# EAGLE design TruthMeterV2 (EAGLE 5.11)
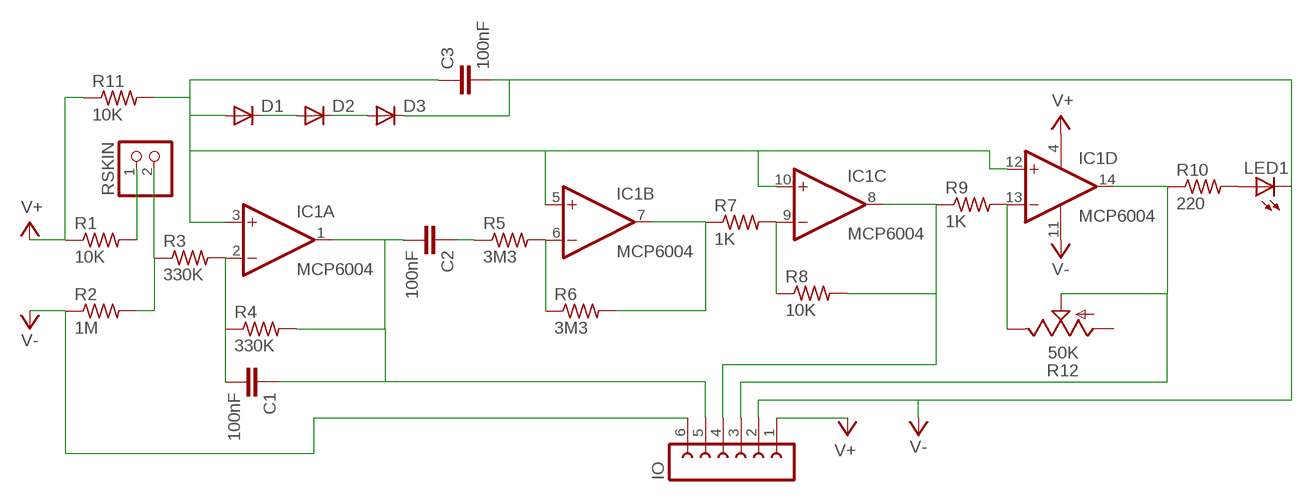
[diagram p0: schematic, sheet 1]

## Parts
C1  100nF  C2,5-3  [C2.5-3]
C2  100nF  C2,5-3  [C2.5-3]
C3  100nF  C2,5-3  [C2.5-3]
D1  1N4148DO35-7  [DO35-7]
D2  1N4148DO35-7  [DO35-7]
D3  1N4148DO35-7  [DO35-7]
IC1  MCP6004  MCP604P  [DIL14]
IO  FE06-1  [FE06]
LED1  LED10MM  [LED10MM]
R1  10K  R-US_0204/7  [0204/7]
R2  1M  R-US_0204/7  [0204/7]
R3  330K  R-US_0204/7  [0204/7]
R4  330K  R-US_0204/7  [0204/7]
R5  3M3  R-US_0204/7  [0204/7]
R6  3M3  R-US_0204/7  [0204/7]
R7  1K  R-US_0204/7  [0204/7]
R8  10K  R-US_0204/7  [0204/7]
R9  1K  R-US_0204/7  [0204/7]
R10  220  R-US_0204/7  [0204/7]
R11  10K  R-US_0204/7  [0204/7]
R12  50K  TRIM_US-CA6V  [CA6V]
RSKIN  PINHD-1X2  [1X02]

## Nets
N$1: R1.2 RSKIN.1
N$2: R2.2 R3.1 RSKIN.2
N$3: C1.2 IC1.2(A:-IN) R3.2 R4.1
N$5: C2.1 R5.1
N$6: IC1.6(B:-IN) R5.2 R6.1
N$7: IC1.7(B:OUT) R6.2 R7.1
N$8: IC1.9(C:-IN) R7.2 R8.1
N$9: IC1.8(C:OUT) IO.4 R8.2 R9.1
N$10: IC1.13(D:-IN) R9.2 R12.E
N$12: D1.C D2.A
N$13: D2.C D3.A
N$14: IC1.14(D:OUT) IO.3 R10.1 R12.S
N$15: LED1.A R10.2
N$18: C3.1 D1.A IC1.3(A:+IN) IC1.5(B:+IN) IC1.10(C:+IN) IC1.12(D:+IN) R11.2
N$19: C1.1 C2.2 IC1.1(A:OUT) IO.5 R4.2
V+: IC1.4(P:V+) IO.1 R1.1 R11.1
V-: C3.2 D3.C IC1.11(P:V-) IO.2 IO.6 LED1.K(C) R2.1
Unconnected: R12.A

## Library data of the parts
C1-C3 = capacitor-wima:C: CAPACITOR naming: grid - package width
D1-D3 = diode:1N4148: DIODE high speed (Philips)
IC1 = linear:MCP604: Quad Op Amp 2.7V to 6.0V Single Supply CMOS Source: http://ww1.microchip.com/downloads/en/DeviceDoc/21314g.pdf
IO = con-lsta:FE06-1: FEMALE HEADER; OC_FARNELL: unknown; OC_NEWARK: unknown
LED1 = led:LED: LED OSRAM: - CHIPLED LG R971, LG N971, LY N971, LG Q971, LY Q971, LO R971, LY R971 LH N974, LH R974 LS Q976, LO Q976, LY Q976 LO Q996 - Hyper CHIPLED LW Q18S LB Q993, LB Q99A, LB R99A - SideLED LS A670, LO A670, LY A670, LG A670, LP A670 LB A673, LV A673, LT A673, LW A673 LH A674 LY A675 LS A676, LA A676, LO A676, LY A676, LW A676 LS A679, LY A679, LG A679 - Hyper Micro SIDELED® LS Y876, LA Y876, LO Y876, LY Y876 LT Y87S - SmartLED LW L88C, LW L88S LB L89C, LB L89S, LG L890 LS L89K, LO L89K, LY L89K LS L896, LA L896, LO L896, LY L896 - TOPLED LS T670, LO T670, LY T670, LG T670, LP T670 LSG T670, LSP T670, LSY T670, LOP T670, LYG T670 LG T671, LOG T671, LSG T671 LB T673, LV T673, LT T673, LW T673 LH T674 LS T676, LA T676, LO T676, LY T676, LB T676, LH T676, LSB T676, LW T676 LB T67C, LV T67C, LT T67C, LS T67K, LO T67K, LY T67K, LW E67C LS E67B, LA E67B, LO E67B, LY E67B, LB E67C, LV E67C, LT E67C LW T67C LS T679, LY T679, LG T679 LS T770, LO T770, LY T770, LG T770, LP T770 LB T773, LV T773, LT T773, LW T773 LH T774 LS E675, LA E675, LY E675, LS T675 LS T776, LA T776, LO T776, LY T776, LB T776 LHGB T686 LT T68C, LB T68C - Hyper Mini TOPLED® LB M676 - Mini TOPLED Santana® LG M470 LS M47K, LO M47K, LY M47K Source: http://www.osram.convergy.de LUXEON: - LUMILED® LXK2-PW12-R00, LXK2-PW12-S00, LXK2-PW14-U00, LXK2-PW14-V00 LXK2-PM12-R00, LXK2-PM12-S00, LXK2-PM14-U00 LXK2-PE12-Q00, LXK2-PE12-R00, LXK2-PE12-S00, LXK2-PE14-T00, LXK2-PE14-U00 LXK2-PB12-K00, LXK2-PB12-L00, LXK2-PB12-M00, LXK2-PB14-N00, LXK2-PB14-P00, LXK2-PB14-Q00 LXK2-PR12-L00, LXK2-PR12-M00, LXK2-PR14-Q00, LXK2-PR14-R00 LXK2-PD12-Q00, LXK2-PD12-R00, LXK2-PD12-S00 LXK2-PH12-R00, LXK2-PH12-S00 LXK2-PL12-P00, LXK2-PL12-Q00, LXK2-PL12-R00 Source: www.luxeon.com KINGBRIGHT: KA-3528ASYC Source: www.kingbright.com
R1-R11 = rcl:R-US_: RESISTOR, American symbol
R12 = pot:TRIM_US-: POTENTIOMETER
RSKIN = pinhead:PINHD-1X2: PIN HEADER

## Board
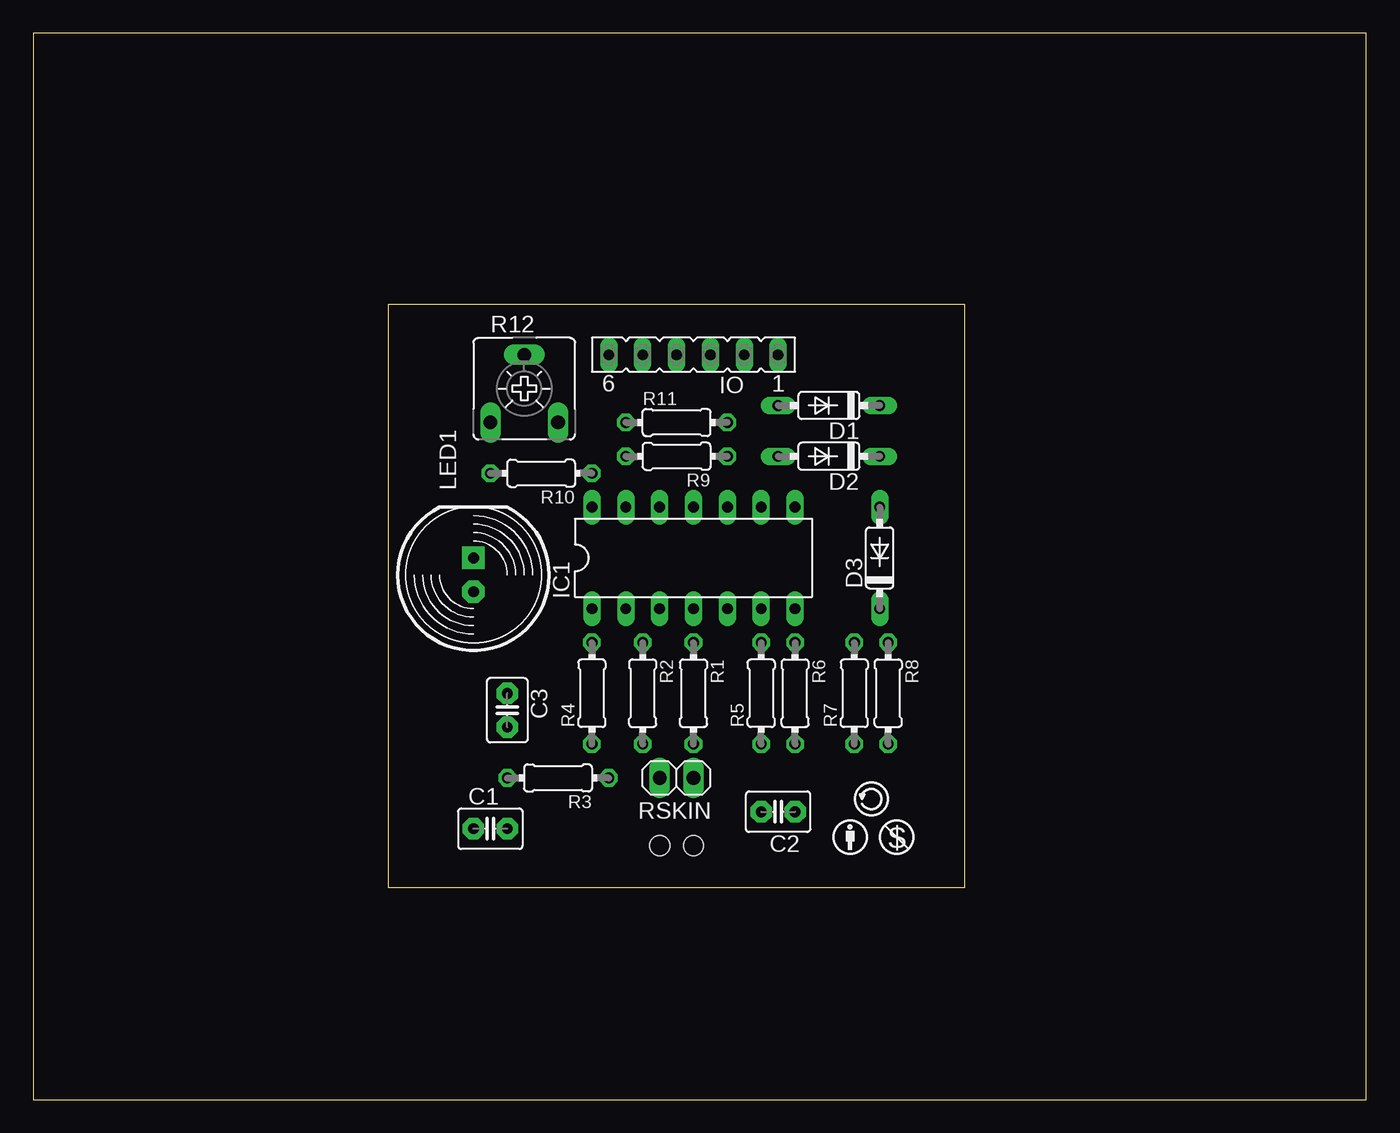
[diagram p1: board, top side]
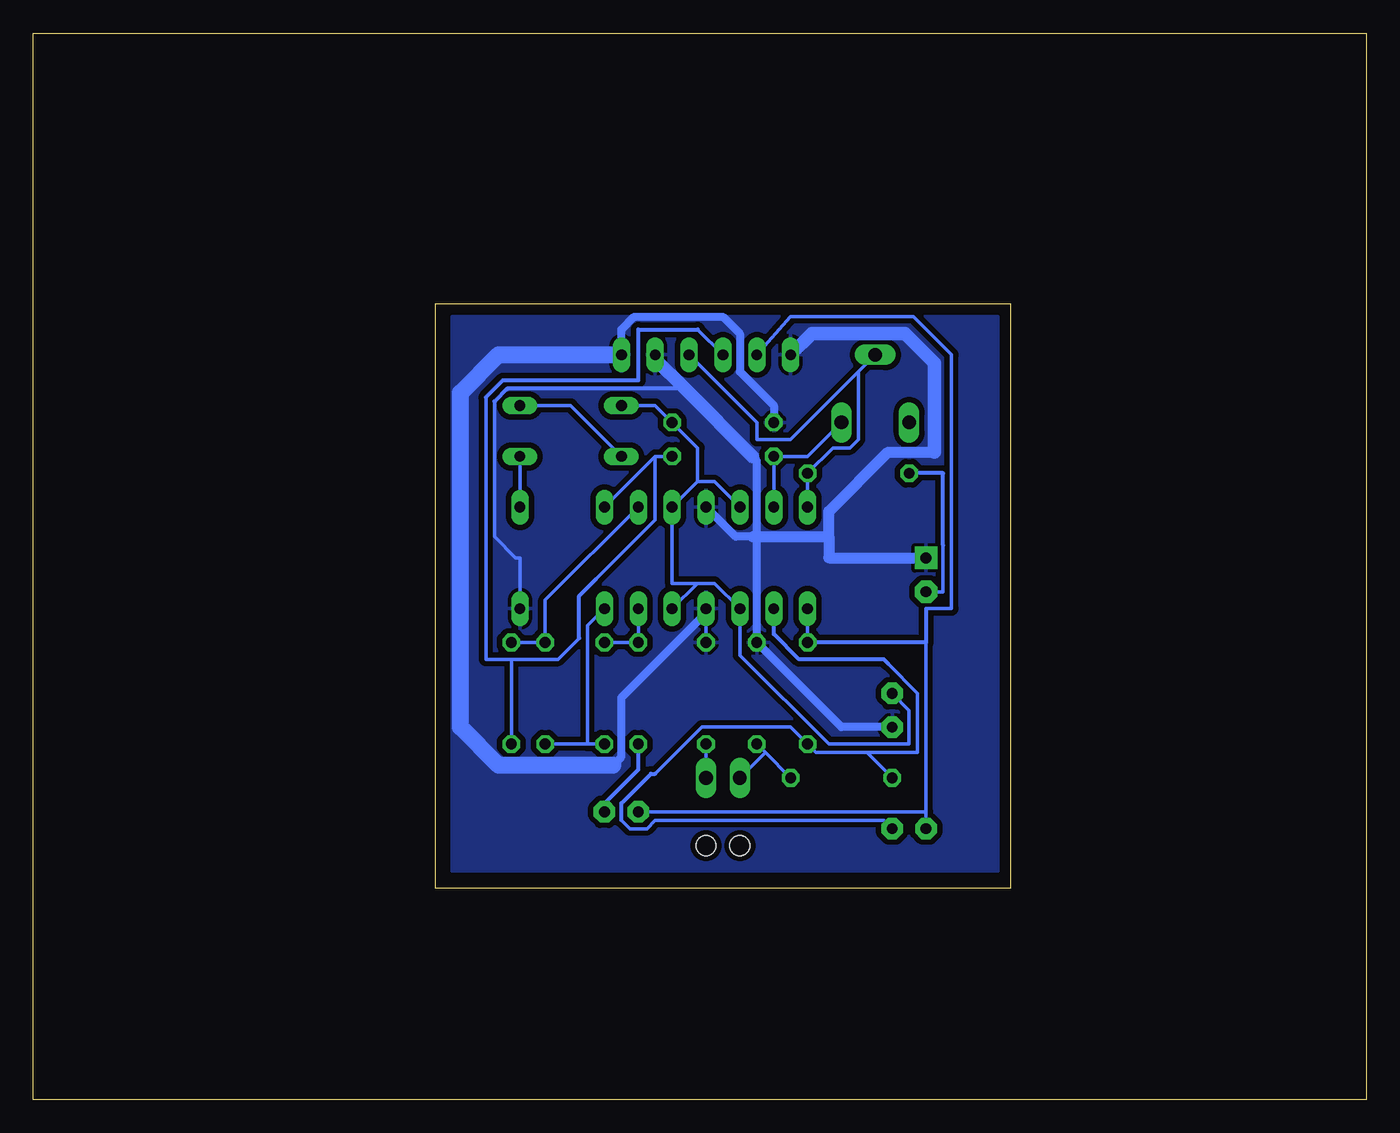
[diagram p2: board, bottom side, seen from below]

Size 100 x 80 mm. Coordinates in mm from the lower left corner, seen from the top.
Outline: 0,0 100,0 100,80 0,80 0,0
Outline: 26.67,59.69 69.85,59.69 69.85,15.88 26.67,15.88 26.67,59.69
Copper layers (1*16): Top 0.035mm / dielectric 1.5mm / Bottom 0.035mm
Design rules "default *": minimum track width 10mil, minimum drill 24mil, track to track 8mil, track to pad 8mil, pad to pad 8mil, via to via 8mil, smd to smd 8mil, copper to edge 15mil, drill to drill 8mil, minimum pad ring 10mil, minimum via ring 8mil, stop-mask expansion 4mil, vias tented up to drill 0mil, thermal gap 10mil
Holes 1.5 mm at 46.99,19.05 49.53,19.05

### Footprints (pad centres in the part's own frame; a part is rotated, then mirrored left to right if it is on the bottom)
C2.5-3 = drill 0.813 pad 1.6 octagon: 1 -1.27,0; 2 1.27,0
DO35-7 = drill 0.813 long: A 3.81,0; C -3.81,0
DIL14 = drill 0.813 long: 1 -7.62,-3.81; 2 -5.08,-3.81; 3 -2.54,-3.81; 4 0,-3.81; 5 2.54,-3.81; 6 5.08,-3.81; 7 7.62,-3.81; 8 7.62,3.81; 9 5.08,3.81; 10 2.54,3.81; 11 0,3.81; 12 -2.54,3.81; 13 -5.08,3.81; 14 -7.62,3.81
FE06 = drill 0.813 long: 1 -6.35,0; 2 -3.81,0; 3 -1.27,0; 4 1.27,0; 5 3.81,0; 6 6.35,0
LED10MM = drill 0.813 pad 1.676 octagon: A -1.27,0 | drill 0.813 pad 1.676 square: K 1.27,0
0204/7 = drill 0.813 octagon: 1 -3.81,0; 2 3.81,0
CA6V = drill 1.016 long: A -2.54,-2.54; E 2.54,-2.54; S 0,2.54
1X02 = drill 1.016 long: 1 -1.27,0; 2 1.27,0

### Placement (x,y rotation side)
C1  34.29,20.32 0 top
C2  55.88,21.59 180 top
C3  35.56,29.21 270 top
D1  59.69,52.07 180 top
D2  59.69,48.26 180 top
D3  63.5,40.64 90 top
IC1  49.53,40.64 0 top
IO  49.53,55.88 180 top
LED1  33.02,39.37 90 top
R1  49.53,30.48 270 top
R2  45.72,30.48 270 top
R3  39.37,24.13 180 top
R4  41.91,30.48 90 top
R5  54.61,30.48 90 top
R6  57.15,30.48 270 top
R7  61.59,30.48 90 top
R8  64.14,30.48 270 top
R9  48.26,48.26 180 top
R10  38.1,46.99 180 top
R11  48.26,50.8 0 top
R12  36.83,53.34 0 top
RSKIN  48.26,24.13 180 top
U$1  [CC_LICENSE_BY]  61.28,19.68 0 top
U$2  [CC_LICENSE_SA]  62.87,22.54 0 top
U$3  [CC_LICENSE_NC]  64.77,19.68 0 top

### Tracks (layer width: path | path; a pad name or v marks a point on that pad's centre or on a via)
N$1
  Bottom 0.254: RSKIN.1 R1.2
N$2
  Bottom 0.254: 45.09,26.04 R2.2 | R3.1 45.09,26.04 | 45.09,26.04 RSKIN.2
N$3
  Bottom 0.254: 37.47,26.04 R3.2 | 37.47,26.04 41.27,26.04 R4.1 43.18,27.94 49.85,27.94 53.34,24.45 | 35.88,32.7 33.66,30.48 33.66,26.04 37.47,26.04 | C1.2 36.2,20.95 53.34,20.95 53.98,20.32 55.24,20.32 55.88,20.95
  Bottom 0.305: 53.34,24.45 53.66,24.45 55.88,22.23 55.88,20.95 | IC1.2 44.45,34.92 42.55,33.02 36.2,33.02 35.88,32.7
N$5
  Bottom 0.305: C2.1 57.15,22.23 54.61,24.77 R5.1
N$6
  Bottom 0.254: IC1.6 R5.2 R6.1
N$7
  Bottom 0.254: 58.42,26.67 R7.1 | R6.2 58.42,26.67 | IC1.7 58.42,35.56 58.42,26.67
N$8
  Bottom 0.254: R8.1 R7.2 61.59,37.47 IC1.9
N$9
  Bottom 0.254: 53.34,48.26 IC1.8 | 53.34,48.26 R9.1 | R8.2 64.14,33.02 | 64.14,33.02 60.64,33.02 59.05,34.61 | 57.78,39.05 53.34,43.5 53.34,48.26 | 50.16,57.78 IO.4 | 66.04,52.7 66.04,33.02 64.14,33.02
  Bottom 0.305: 50.16,57.78 54.61,57.78 54.61,53.98 64.77,53.98 66.04,52.7 | 59.05,34.61 59.05,37.78 57.78,39.05
N$10
  Bottom 0.254: IC1.13 R9.2 41.91,48.26 R12.E
N$12
  Bottom 0.254: D2.A 59.69,52.07 D1.C
N$13
  Bottom 0.254: D3.A D2.C
N$14
  Bottom 0.254: IC1.14 R10.1 40.01,48.9 38.73,48.9 38.1,49.53 38.1,54.61 | IO.3 45.72,50.8 45.72,49.53 43.18,49.53 38.1,54.61 | 38.1,54.61 R12.S
N$15
  Bottom 0.254: 31.75,41.59 31.75,38.1 LED1.A
  Bottom 0.305: 31.75,41.59 31.75,46.99 R10.2
N$18
  Bottom 0.254: D1.A 53.34,52.07 R11.2 50.16,48.9 50.16,46.35 | IC1.12 48.9,46.35 50.16,46.35 | 50.16,46.35 IC1.10 52.07,38.73 50.16,38.73 | 50.16,38.73 48.9,38.73 IC1.3 46.99,33.34 40.32,26.67 34.29,26.67 34.29,29.21 C3.1 | 50.16,38.73 IC1.5
N$19
  Bottom 0.254: R4.2 IC1.1 | IO.5 43.18,58.74 33.97,58.74 31.11,55.88 31.11,36.83 33.02,36.83 33.02,21.59 | C1.1 33.02,21.59 | 33.02,21.59 C2.2
  Bottom 0.305: 33.02,36.83 33.02,34.29 R4.2
V+
  Bottom 0.254: IC1.4 R1.1
  Bottom 0.61: R11.1 44.45,52.07 46.99,54.61 46.99,57.47 48.26,58.74 54.93,58.74 55.88,57.78 IO.1 | IC1.4 49.53,36.51 55.88,30.16 55.88,25.72 56.52,25.08
  Bottom 1.27: 56.52,25.08 65.09,25.08 67.94,27.94 67.94,53.02 65.09,55.88 IO.1
  pour Bottom (isolate 0.406): 27.62,17.14 68.58,17.14 68.58,58.74 27.62,58.74
V-
  Bottom 0.254: D3.C 63.5,40.64 63.82,40.64 65.41,42.23 65.41,52.39
  Bottom 0.305: 65.41,52.39 64.45,53.34 51.12,53.34
  Bottom 0.61: 46.04,48.26 45.72,47.94 45.72,42.55 46.04,42.23 47.31,42.23 IC1.11 | 45.72,42.23 R2.1 39.37,27.94 C3.2
  Bottom 0.813: 32.38,48.58 35.88,48.58 40.32,44.13 40.32,42.23 | 40.32,42.23 45.72,42.23 46.04,42.23 | LED1.K 40.32,40.64 40.32,42.23
  Bottom 1.016: IO.2 53.34,55.56 51.12,53.34 46.04,48.26 | IO.6 41.59,57.47 34.61,57.47 32.38,55.24 32.38,48.58
  pour Bottom (isolate 0.406): 29.53,59.05 69.22,59.05 68.9,17.14 29.21,17.14

### Text on the board
tDocu: www.ProduceConsumeRobot.com | Truth Meter v2.100